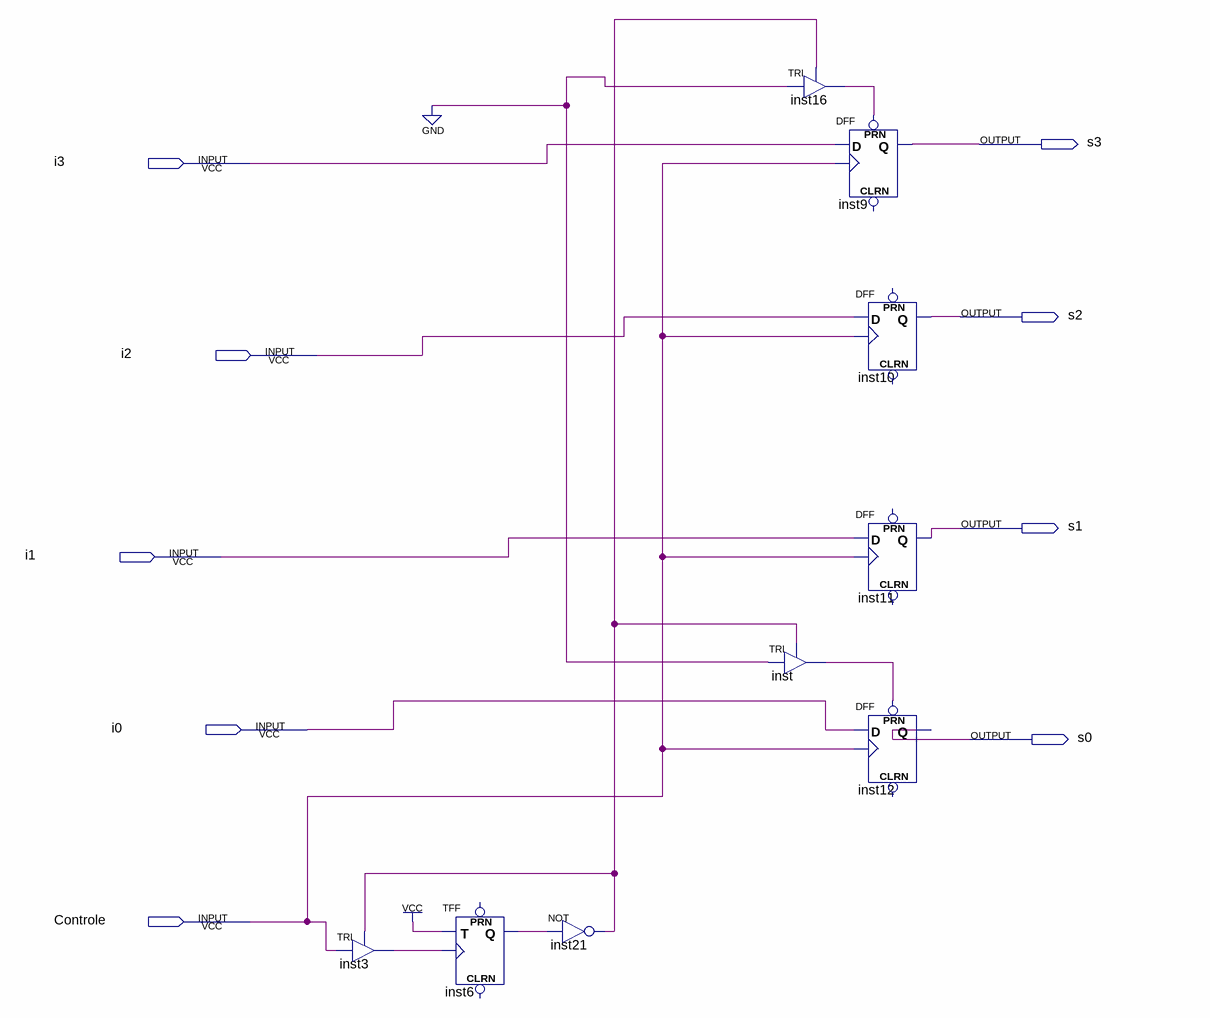
[diagram p0: schematic sheet]
// Quartus schematic Memoria4bitsDIG9.bdf as structural Verilog: 9 symbols, 9 pins
module Memoria4bitsDIG9 (
  input  i3,
  input  i2,
  input  i1,
  input  i0,
  input  Controle,
  output s3,
  output s2,
  output s1,
  output s0
);

  wire inst3_out, inst6_q, inst16_out, inst21_out, inst_out;

  TRI inst3 (.IN(Controle), .OE(inst21_out), .OUT(inst3_out));
  TFF inst6 (.T(1'b1), .CLK(inst3_out), .Q(inst6_q));  // open: PRN, CLRN
  not inst21 (inst21_out, inst6_q);
  TRI inst (.IN(1'b0), .OE(inst21_out), .OUT(inst_out));
  TRI inst16 (.IN(1'b0), .OE(inst21_out), .OUT(inst16_out));
  DFF inst9 (.CLK(Controle), .D(i3), .PRN(inst16_out), .Q(s3));  // open: CLRN
  DFF inst10 (.CLK(Controle), .D(i2), .Q(s2));  // open: CLRN, PRN
  DFF inst11 (.CLK(Controle), .D(i1), .Q(s1));  // open: CLRN, PRN
  DFF inst12 (.CLK(Controle), .D(i0), .PRN(inst_out), .Q(s0));  // open: CLRN
endmodule
